# Altium schematic sheet 原理图.SchDoc
size A4
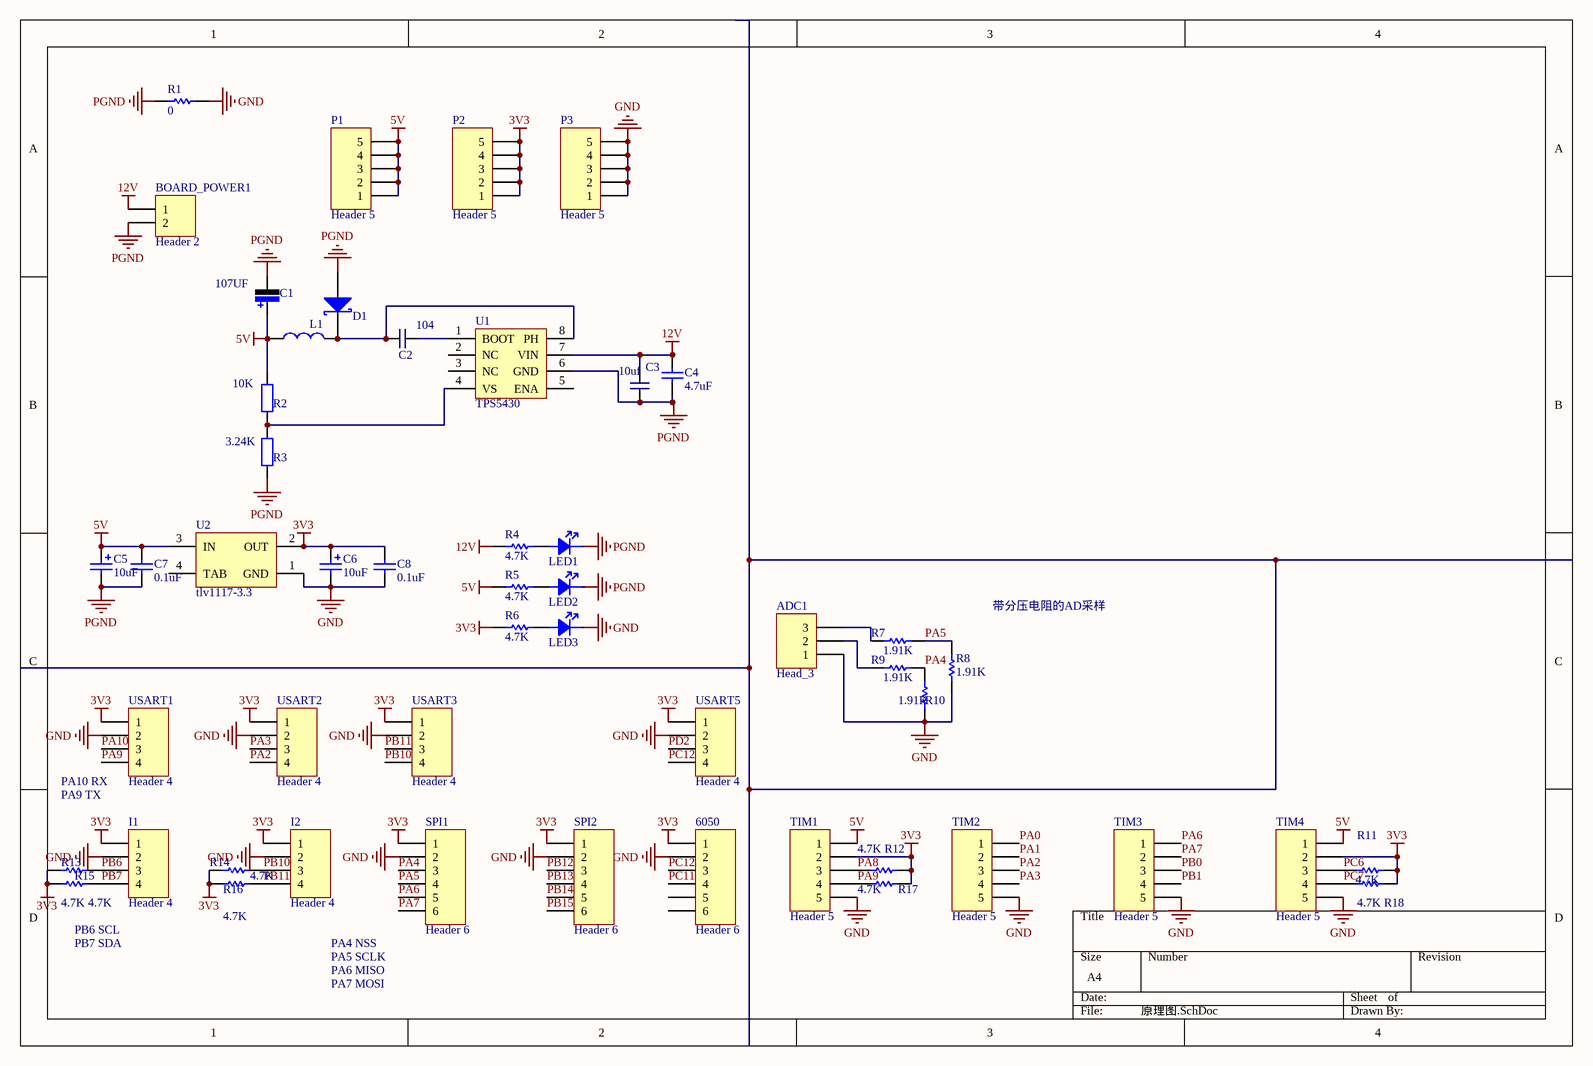
[diagram p0: 原理图.SchDoc]

## Parts
6050  Header 6  [HDR1X6- duplicate]
ADC1  Head_3  [HDR1X3]
BOARD_POWER1  Header 2  [Green_2P]
C1  107UF  [6032C  TA]
C2  104  [0603- C]
C3  10uf  [0805C]
C4  value 4.7uF  [CAP-MLCC-0603]  (hidden comment: Cap)
C5  value 10uF  [6032C]  (hidden comment: Cap Pol1)
C6  value 10uF  [6032C]  (hidden comment: Cap Pol1)
C7  value 0.1uF  [CAP-MLCC-0603]  (hidden comment: Cap)
C8  value 0.1uF  [CAP-MLCC-0603]  (hidden comment: Cap)
D1  D  [D RS1M]  (value not drawn)
I1  Header 4  [HDR1X4]
I2  Header 4  [HDR1X4]
L1  L  [CD_54]  (value not drawn)
LED1  lED  [0805D]  (value not drawn)
LED2  lED  [0805D]  (value not drawn)
LED3  lED  [0805D]  (value not drawn)
P1  Header 5  [HDR1X5]
P2  Header 5  [HDR1X5]
P3  Header 5  [HDR1X5]
R1  value 0  [RES-0603]  (hidden comment: Res1)
R2  10K  [0603-R]
R3  3.24K  [0603-R]
R4  value 4.7K  [RES-0603]  (hidden comment: Res1)
R5  value 4.7K  [RES-0603]  (hidden comment: Res1)
R6  value 4.7K  [RES-0603]  (hidden comment: Res1)
R7  value 1.91K  [RES-0603]  (hidden comment: Res1)
R8  value 1.91K  [RES-0603]  (hidden comment: Res1)
R9  value 1.91K  [RES-0603]  (hidden comment: Res1)
R10  value 1.91K  [RES-0603]  (hidden comment: Res1)
R11  value 4.7K  [RES-0603]  (hidden comment: Res1)
R12  value 4.7K  [RES-0603]  (hidden comment: Res1)
R13  value 4.7K  [RES-0603]  (hidden comment: Res1)
R14  value 4.7K  [RES-0603]  (hidden comment: Res1)
R15  value 4.7K  [RES-0603]  (hidden comment: Res1)
R16  value 4.7K  [RES-0603]  (hidden comment: Res1)
R17  value 4.7K  [RES-0603]  (hidden comment: Res1)
R18  value 4.7K  [RES-0603]  (hidden comment: Res1)
SPI1  Header 6  [HDR1X6]
SPI2  Header 6  [HDR1X6]
TIM1  Header 5  [HDR1X5]
TIM2  Header 5  [HDR1X5]
TIM3  Header 5  [HDR1X5]
TIM4  Header 5  [HDR1X5]
U1  TPS5430  [SOIC-8piN]
U2  tlv1117-3.3  [LM1117]
USART1  Header 4  [HDR1X4]
USART2  Header 4  [HDR1X4]
USART3  Header 4  [HDR1X4]
USART5  Header 4  [HDR1X4]

## Nets
3V3: 6050.1 C6.1 C8.2 I1.1 I2.1 P2.1 P2.2 P2.3 P2.4 P2.5 R6.2 R11.1 R12.1 R13.2 R14.2 R15.2 R16.2 R17.1 R18.1 SPI1.1 SPI2.1 TIM1.2 TIM4.2 U2.2(OUT) USART1.1 USART2.1 USART3.1 USART5.1
5V: C1.1 C5.1 C7.2 L1.2 P1.1 P1.2 P1.3 P1.4 P1.5 R2.2 R5.2 TIM1.1 TIM4.1 U2.3(IN)
12V: BOARD_POWER1.1 C3.2 C4.2 R4.2 U1.7(VIN)
GND: 6050.2 ADC1.1 C6.2 C8.1 I1.2 I2.2 LED3.K P3.1 P3.2 P3.3 P3.4 P3.5 R1.2 R8.2 R10.2 SPI1.2 SPI2.2 TIM1.5 TIM2.5 TIM3.5 TIM4.5 U2.1(GND) USART1.2 USART2.2 USART3.2 USART5.2
PGND: BOARD_POWER1.2 C1.2 C3.1 C4.1 C5.2 C7.1 D1.A LED1.K LED2.K R1.1 R3.2 U1.6(GND)
PA0: TIM2.1
PA1: TIM2.2
PA2: TIM2.3 USART2.4
PA3: TIM2.4 USART2.3
PA4: R9.1 R10.1 SPI1.3
PA5: R7.1 R8.1 SPI1.4
PA6: SPI1.5 TIM3.1
PA7: SPI1.6 TIM3.2
PA8: R12.2 TIM1.3
PA9: R17.2 TIM1.4 USART1.4
PA10: USART1.3
PB0: TIM3.3
PB1: TIM3.4
PB6: I1.3 R13.1
PB7: I1.4 R15.1
PB10: I2.3 R14.1 USART3.4
PB11: I2.4 R16.1 USART3.3
PB12: SPI2.3
PB13: SPI2.4
PB14: SPI2.5
PB15: SPI2.6
PC6: R11.2 TIM4.3
PC7: R18.2 TIM4.4
PC11: 6050.4
PC12: 6050.3 USART5.4
PD2: USART5.3
NetADC1_2: ADC1.2 R9.2
NetADC1_3: ADC1.3 R7.2
NetC2_1: C2.1 U1.1(BOOT)
NetC2_2: C2.2 D1.K L1.1 U1.8(PH)
NetLED1_A: LED1.A R4.1
NetLED2_A: LED2.A R5.1
NetLED3_A: LED3.A R6.1
NetR2_1: R2.1 R3.1 U1.4(VS)

Not connected (* = marked no-connect by the designer): 6050 5 6; U1 2(NC) 3(NC) 5(ENA); U2 4(TAB)

## Notes on the sheet
- 带分压电阻的AD采样
- (near USART1) PA10 RX
- PA9 TX
- PB6 SCL
- PB7 SDA
- PA4 NSS
- PA5 SCLK
- PA6 MISO
- PA7 MOSI

## Library data of the parts
6050 = Header 6: 接插件; LatestRevisionDate: 17-Jul-2002; LatestRevisionNote: Re-released for DXP Platform.; Publisher: Altium Limited
BOARD_POWER1 = Header 2: Header, 2-Pin; LatestRevisionDate: 17-Jul-2002; LatestRevisionNote: Re-released for DXP Platform.; Publisher: Altium Limited
C1 = Cap_2: 钽电容
C2 C3 = Cap
C4 C7 C8 = Cap: Capacitor; Published: 8-Jun-2000; LatestRevisionDate: 17-Jul-2002; LatestRevisionNote: Re-released for DXP Platform.; PackageReference: RAD-0.3; Publisher: Altium Limited
C5 C6 = Cap Pol1: Polarized Capacitor (Radial); Published: 8-Jun-2000; LatestRevisionDate: 17-Jul-2002; LatestRevisionNote: Re-released for DXP Platform.; PackageReference: RB7.6-15; Publisher: Altium Limited
I1 I2 USART1-USART3 USART5 = Header 4: Header, 4-Pin; LatestRevisionDate: 17-Jul-2002; LatestRevisionNote: Re-released for DXP Platform.; Publisher: Altium Limited
L1 = L: 电感
LED1-LED3 = 00-D-LED
P1-P3 TIM1-TIM4 = Header 5: Header, 5-Pin; LatestRevisionDate: 17-Jul-2002; LatestRevisionNote: Re-released for DXP Platform.; Publisher: Altium Limited
R1 R4-R18 = Res1: Resistor; Published: 8-Jun-2000; LatestRevisionDate: 17-Jul-2002; LatestRevisionNote: Re-released for DXP Platform.; PackageReference: AXIAL-0.3; Publisher: Altium Limited
R2 R3 = R
SPI1 SPI2 = Header 6: Header, 6-Pin; LatestRevisionDate: 17-Jul-2002; LatestRevisionNote: Re-released for DXP Platform.; Publisher: Altium Limited
U2 = LM1117IMP-5.0: 800mA Low-Dropout Linear Regulator; Manufacturer: National Semiconductor; CompType: LDO IC; PackageTopMarking: XYTT*N06B; PowerWise: N; Published: 4-Dec-2008; DatasheetVersion: Apr-2006; PackageVersion: revB, Apr-2003; PackageReference: MP04A; Publisher: Altium Limited; PackageDescription: Molded SOT-223, 6.50 x 3.56 x 1.6mm Body, 4 Lead, 2.3mm Pitch; PartNumber: LM1117IMP-5.0; RoHS: O; PinCount: 4; DigiKeyPartNumber: LM1117IMP-5.0CT-ND; Code_JEDEC: TO-261-AA; Code_IPC: SOT223-4; ComponentLink1Description: LM1117 Datasheet; ComponentLink1URL: http://www.national.com/ds/LM/LM1117.pdf; ComponentLink2Description: LM1117 Web Page; ComponentLink2URL: http://www.national.com/pf/LM/LM1117.html; ComponentLink3Description: MP04A Package Page; ComponentLink3URL: http://www.national.com/packaging/folders/mp04a.html